# Altium schematic sheet 9_M.2_B+M.SchDoc
size A; SheetNumber: 9; SheetTotal: 9
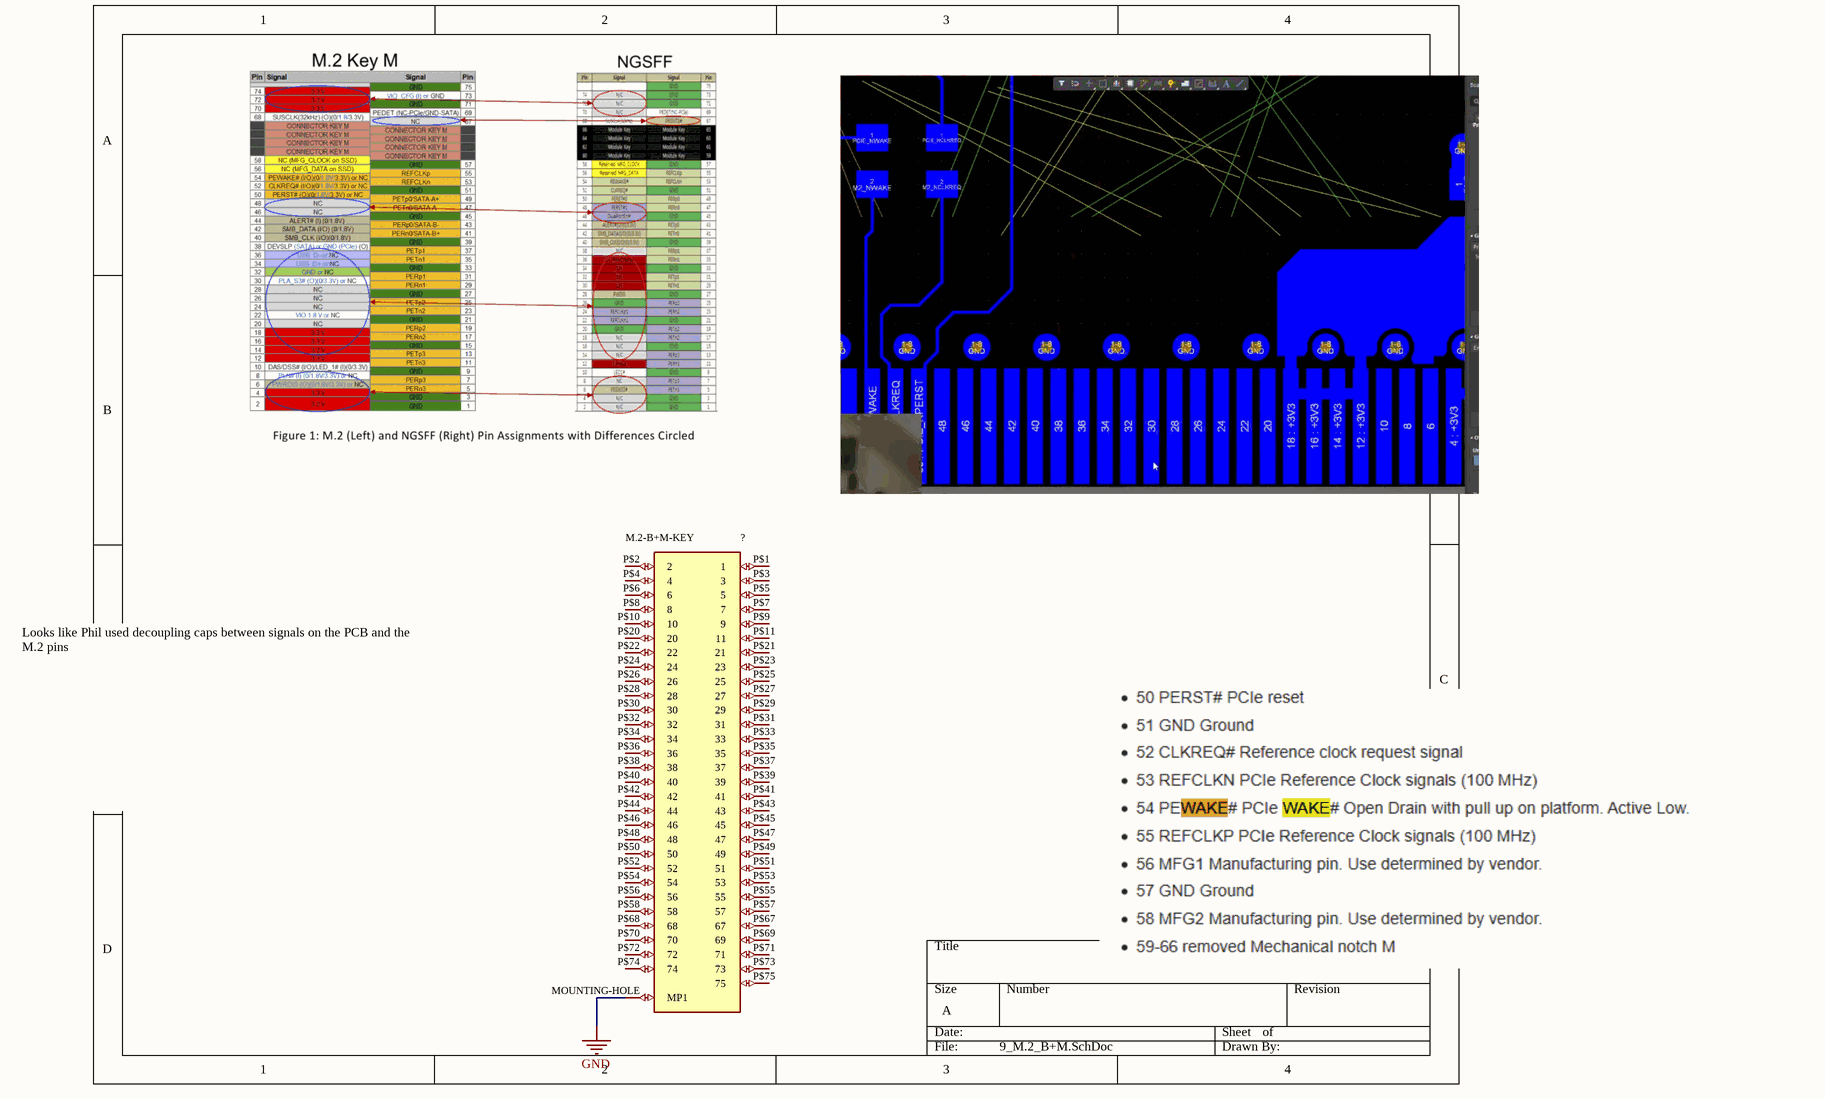
[diagram p0: 9_M.2_B+M.SchDoc]

## Parts
?  M.2-B+M-KEY  [M-2-B+M-KEY]

## Nets
GND: ?.MOUNTING-HOLE(MP1)

Not connected (* = marked no-connect by the designer): ? P$1(1) P$2(2) P$3(3) P$4(4) P$5(5) P$6(6) P$7(7) P$8(8) P$9(9) P$10(10) P$11(11) P$20(20) P$21(21) P$22(22) P$23(23) P$24(24) P$25(25) P$26(26) P$27(27) P$28(28) P$29(29) P$30(30) P$31(31) P$32(32) P$33(33) P$34(34) P$35(35) P$36(36) P$37(37) P$38(38) P$39(39) P$40(40) P$41(41) P$42(42) P$43(43) P$44(44) P$45(45) P$46(46) P$47(47) P$48(48) P$49(49) P$50(50) P$51(51) P$52(52) P$53(53) P$54(54) P$55(55) P$56(56) P$57(57) P$58(58) P$67(67) P$68(68) P$69(69) P$70(70) P$71(71) P$72(72) P$73(73) P$74(74) P$75(75)

## Notes on the sheet
- Looks like Phil used decoupling caps between signals on the PCB and the M.2 pins

## Library data of the parts
? = CMP-026-000000-1: GateName_1: G$1; Package: M.2-B+M-KEY; Source: M.Schlib; Component Type: Standard; SymbolName_1: M.2-B+M-KEY; LibraryName: M.2-Templates; Pin Count: 60; DeviceSetName: M.2-B+M-KEY; Design Item ID: M.2-B+M-KEY